# Altium schematic sheet linear_regulator.SchDoc
size A3
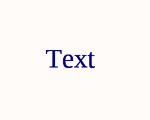
[diagram p0: linear_regulator.SchDoc]

## Notes on the sheet
- Text